# Altium schematic sheet 1.SchDoc
size A; SheetNumber: 1; SheetTotal: 1
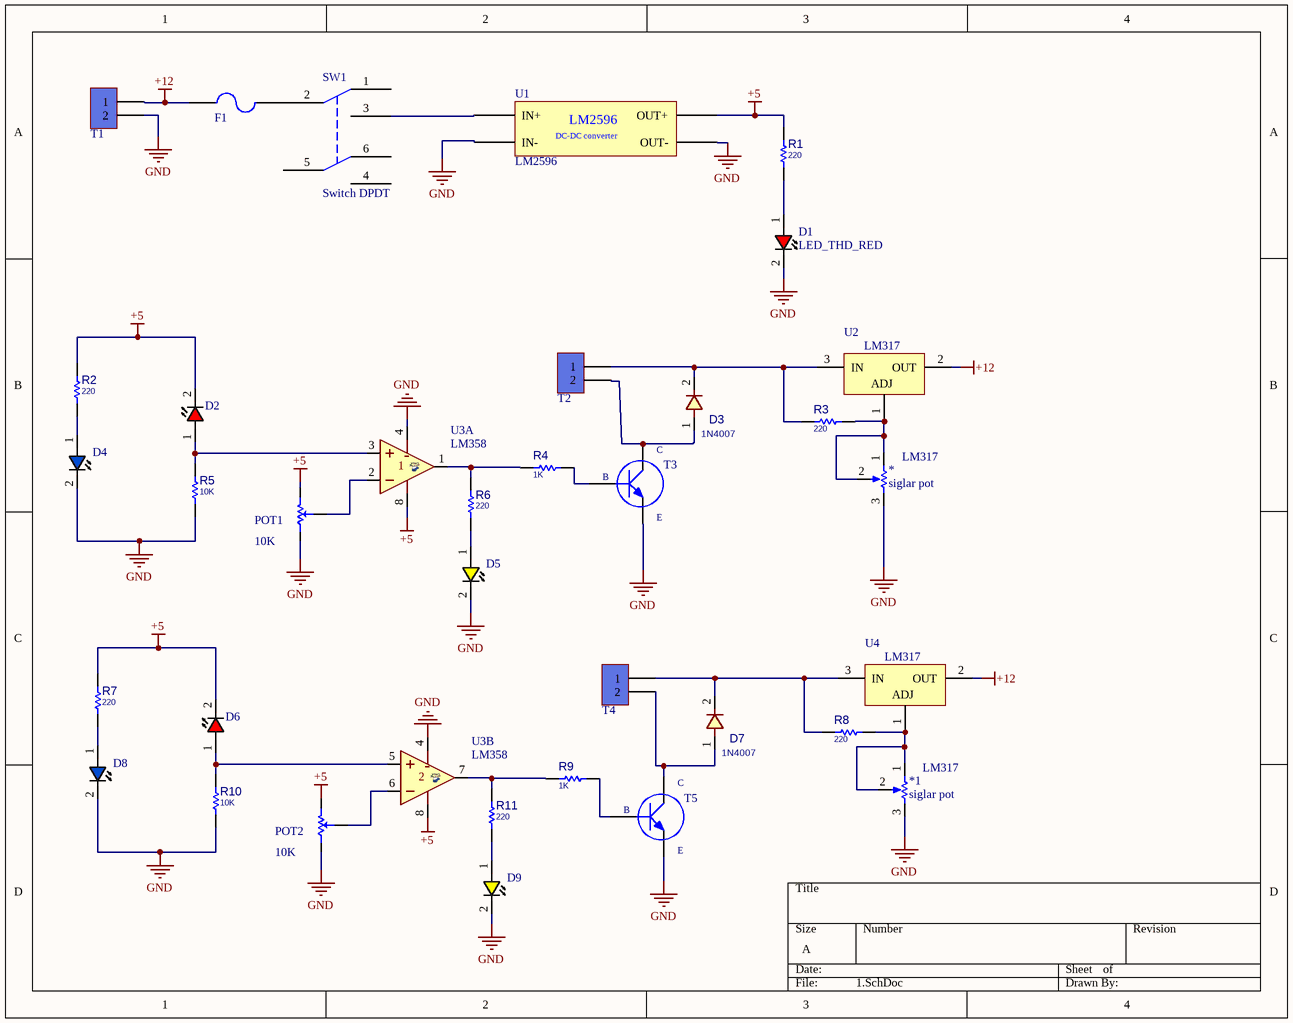
[diagram p0: 1.SchDoc]

## Parts
*  siglar pot  [VOL_R]
*1  siglar pot  [VOL_R]
D1  LED_THD_RED  [LED5MM_RED]
D2  LED_THD_RED  [LED5MM_RED]  (value not drawn)
D3  1N4007  [D_AX04_DO41]
D4  LED_THD_BLU  [LED5MM_BLU]  (value not drawn)
D5  LED_THD_YLW  [LED5MM_YLO]  (value not drawn)
D6  LED_THD_RED  [LED5MM_RED]  (value not drawn)
D7  1N4007  [D_AX04_DO41]
D8  LED_THD_BLU  [LED5MM_BLU]  (value not drawn)
D9  LED_THD_YLW  [LED5MM_YLO]  (value not drawn)
F1  F=1.0 A  [Fuse 5x20 With holder pin]  (value not drawn)
POT1  10K  [POT 4]
POT2  10K  [POT 4]
R1  220  [R025W_AX04]
R2  220  [R025W_AX04]
R3  220  [R025W_AX04]
R4  1K  [R025W_AX04]
R5  10K  [R025W_AX04]
R6  220  [R025W_AX04]
R7  220  [R025W_AX04]
R8  220  [R025W_AX04]
R9  1K  [R025W_AX04]
R10  10K  [R025W_AX04]
R11  220  [R025W_AX04]
SW1  Switch DPDT  [Switch DPDT]
T1  KF301_Terminal  [KF301 2PIN]  (value not drawn)
T2  KF301_Terminal  [KF301 2PIN]  (value not drawn)
T3  NPN  [TO-220]  (value not drawn)
T4  KF301_Terminal  [KF301 2PIN]  (value not drawn)
T5  NPN  [TO-220]  (value not drawn)
U1  LM2596  [LM2596_MODULE]
U2  LM317  [TO-220]
U3  LM358  [DIP_8]  (parts A,B of 2)
U4  LM317  [TO-220]

## Nets
+5: D2.2(CATHODE) D6.2(CATHODE) POT1.2(CW) POT2.2(CW) R1.2 R2.2 R7.2 U1.4(OUT+) U3.8(V+)
+12: F1.1 T1.1 U2.2(OUT) U4.2(OUT)
GND: *.3(BOT) *1.3(BOT) D1.2(CATHODE) D4.2(CATHODE) D5.2(CATHODE) D8.2(CATHODE) D9.2(CATHODE) POT1.1(CCW) POT2.1(CCW) R5.1 R10.1 T1.2 T3.3(E) T5.3(E) U1.2(IN-) U1.3(OUT-) U3.4(V-)
Net*1_1: *1.1(TOP) *1.2(TAP) R8.1 U4.1(ADJ)
Net*_1: *.1(TOP) *.2(TAP) R3.1 U2.1(ADJ)
NetD1_1: D1.1(ANODE) R1.1
NetD2_1: D2.1(ANODE) R5.2 U3.3(IN+)
NetD3_1: D3.1 T2.2 T3.2(C)
NetD3_2: D3.2 R3.2 T2.1 U2.3(IN)
NetD4_1: D4.1(ANODE) R2.1
NetD5_1: D5.1(ANODE) R6.1
NetD6_1: D6.1(ANODE) R10.2 U3.5(IN+)
NetD7_1: D7.1 T4.2 T5.2(C)
NetD7_2: D7.2 R8.2 T4.1 U4.3(IN)
NetD8_1: D8.1(ANODE) R7.1
NetD9_1: D9.1(ANODE) R11.1
NetF1_2: F1.2 SW1.2
NetPOT1_3: POT1.3(SetPoint) U3.2(IN-)
NetPOT2_3: POT2.3(SetPoint) U3.6(IN-)
NetR4_1: R4.1 T3.1(B)
NetR4_2: R4.2 R6.2 U3.1(OUT)
NetR9_1: R9.1 T5.1(B)
NetR9_2: R9.2 R11.2 U3.7(OUT)
NetSW1_3: SW1.3 U1.1(IN+)

Not connected (* = marked no-connect by the designer): SW1 1 4 5 6

## Library data of the parts
D1 D2 D6 = LED_THD_RED: LED, THD, RED; PARAM: *; MANF: *; ASSEMBLY: *; PRICE: *; DESC: *; MANF_P#: *; PARAM2: *; VALUE: *
D3 D7 = DIODE_THD_1N4007: DIODE, GENERAL PURPOSE, 1000V/1A; MANF: Diodes; DESC: DESCRIPTION; PARAM: 1000V, 1.15V; PARAM2: 1.5A; ASSEMBLY: ASSEMBLY; PRICE: PRICE; MANF_P#: 1N4007; VALUE: 1N4007
D4 D8 = LED_THD_BLU: LED, THD, BLU; PARAM: *; MANF: *; ASSEMBLY: *; PRICE: *; DESC: *; MANF_P#: *; PARAM2: *; VALUE: *
D5 D9 = LED_THD_YLW: LED, THD, YELLOW; PARAM: *; MANF: *; ASSEMBLY: *; PRICE: *; DESC: *; MANF_P#: *; PARAM2: *; VALUE: *
F1 = Fuse 5x20 with holdeer pins: Fuses 5x20; Designer: Abbas Basereh; Desc.: fuse with holder pins 5x20; Data: 28-12-2016
POT1 POT2 = POT: Variable Resistor; Value: 10K
R1-R11 = RES_THD: RESISTOR, THD; MANF_P#: RK73H1ETTP4701F; MANF: KOA SPEER; PARAM: 0.063W; DESC: DESCRIPTION; DIST#: MOUSER; PARAM2: 1%; ASSEMBLY: ASSEMBLY; PRICE: 100= 0.5$
  R1-R3 R6-R8 R11: VALUE: 220
  R4 R9: VALUE: 1K
  R5 R10: VALUE: 10K
T1 T2 T4 = KF301-2Pin_Terminal: Terminal 2 Pin 250VAC 16A; Part. No: KF301 2P; Designer: Abbas Basereh; Link: https://www.aliexpress.com/item/
T3 T5 = TIP41
U1 = LM2596_ADJ: DC-DC converter
U3 = LM358_DIP8: AMP, Dual, Low-Power; MANF: Texas Instruments, Fairchild; MANF_P#: LM358AN; PARAM2: 3 V ~ 32 V, ±1.5 V ~ 16 V; PRICE: -; VALUE: LM358